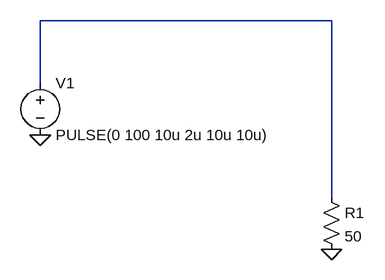
[diagram p0: schematic Draft3.asc]
Draft3.asc, the LTspice schematic file:
Version 4
SHEET 1 880 680
WIRE 240 32 -208 32
WIRE -208 128 -208 32
WIRE 240 304 240 32
FLAG -208 208 0
FLAG 240 384 0
SYMBOL voltage -208 112 R0
WINDOW 123 0 0 Left 0
WINDOW 39 0 0 Left 0
SYMATTR InstName V1
SYMATTR Value PULSE(0 100 10u 2u 10u 10u)
SYMBOL res 224 288 R0
SYMATTR InstName R1
SYMATTR Value 50

The netlist it stands for:
* Draft3.asc
V1 N001 0 PULSE(0 100 10u 2u 10u 10u)
R1 N001 0 50
.backanno
.end